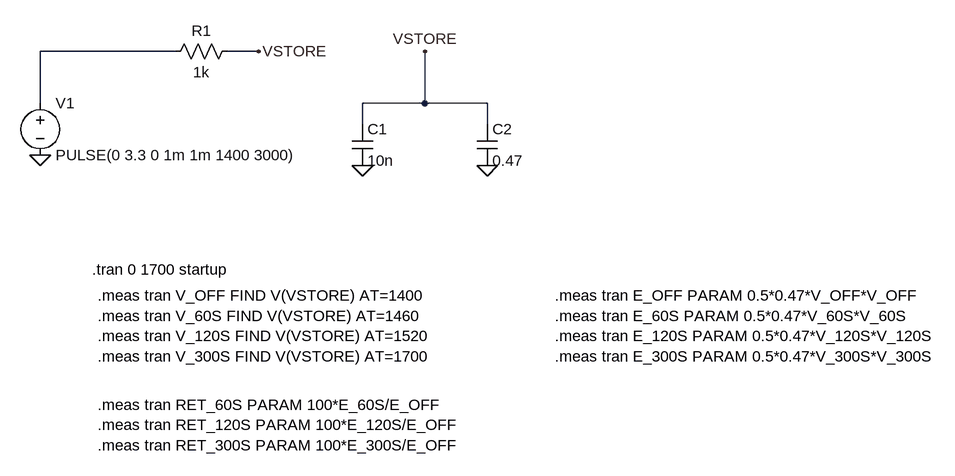
[diagram p0: schematic V1B_A_DirectPath.asc]
V1B_A_DirectPath.asc, the LTspice schematic file:
Version 4.1
SHEET 1 1588 788
WIRE 288 160 80 160
WIRE 416 160 368 160
WIRE 80 240 80 160
WIRE 672 240 672 160
WIRE 672 240 576 240
WIRE 768 240 672 240
WIRE 576 272 576 240
WIRE 768 272 768 240
FLAG 80 320 0
FLAG 576 336 0
FLAG 768 336 0
FLAG 416 160 VSTORE
FLAG 672 160 VSTORE
SYMBOL voltage 80 224 R0
SYMATTR InstName V1
SYMATTR Value PULSE(0 3.3 0 1m 1m 1400 3000)
SYMBOL res 384 144 R90
WINDOW 0 0 56 VBottom 2
WINDOW 3 32 56 VTop 2
SYMATTR InstName R1
SYMATTR Value 1k
SYMBOL cap 560 272 R0
SYMATTR InstName C1
SYMATTR Value 10n
SYMBOL cap 752 272 R0
SYMATTR InstName C2
SYMATTR Value 0.47
TEXT 160 496 Left 2 !.tran 0 1700 startup
TEXT 168 536 Left 2 !.meas tran V_OFF FIND V(VSTORE) AT=1400\n.meas tran V_60S FIND V(VSTORE) AT=1460\n.meas tran V_120S FIND V(VSTORE) AT=1520\n.meas tran V_300S FIND V(VSTORE) AT=1700
TEXT 872 536 Left 2 !.meas tran E_OFF PARAM 0.5*0.47*V_OFF*V_OFF\n.meas tran E_60S PARAM 0.5*0.47*V_60S*V_60S\n.meas tran E_120S PARAM 0.5*0.47*V_120S*V_120S\n.meas tran E_300S PARAM 0.5*0.47*V_300S*V_300S
TEXT 168 704 Left 2 !.meas tran RET_60S PARAM 100*E_60S/E_OFF\n.meas tran RET_120S PARAM 100*E_120S/E_OFF\n.meas tran RET_300S PARAM 100*E_300S/E_OFF

The netlist it stands for:
* V1B_A_DirectPath.asc
V1 N001 0 PULSE(0 3.3 0 1m 1m 1400 3000)
R1 VSTORE N001 1k
C1 VSTORE 0 10n
C2 VSTORE 0 0.47
.tran 0 1700 startup
.meas tran V_OFF FIND V(VSTORE) AT=1400
.meas tran V_60S FIND V(VSTORE) AT=1460
.meas tran V_120S FIND V(VSTORE) AT=1520
.meas tran V_300S FIND V(VSTORE) AT=1700
.meas tran E_OFF PARAM 0.5*0.47*V_OFF*V_OFF
.meas tran E_60S PARAM 0.5*0.47*V_60S*V_60S
.meas tran E_120S PARAM 0.5*0.47*V_120S*V_120S
.meas tran E_300S PARAM 0.5*0.47*V_300S*V_300S
.meas tran RET_60S PARAM 100*E_60S/E_OFF
.meas tran RET_120S PARAM 100*E_120S/E_OFF
.meas tran RET_300S PARAM 100*E_300S/E_OFF
.backanno
.end